# Altium schematic sheet Sheet1.SchDoc
size A4; SheetNumber: 1; SheetTotal: 3
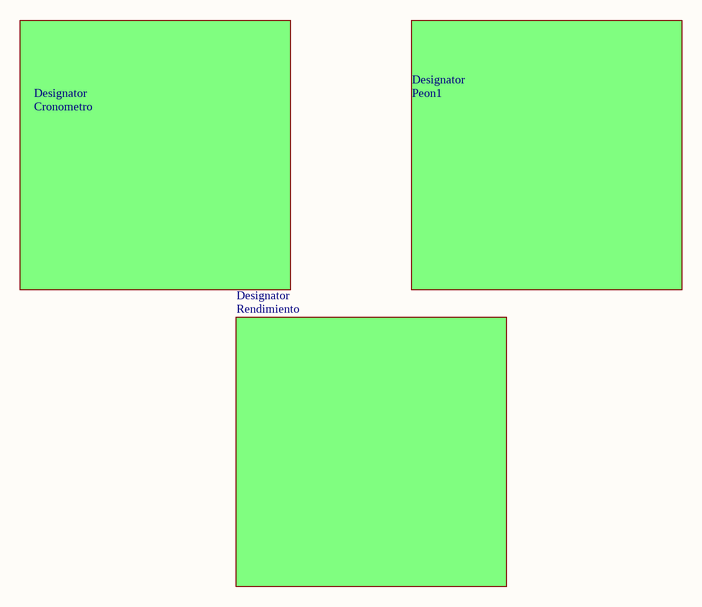
[diagram p0: Sheet1.SchDoc]

## Sub-sheets
Designator = Cronometro: no entries
Designator = Peon1: no entries
Designator = Rendimiento: no entries